# EAGLE design Detectors (EAGLE 5.04)
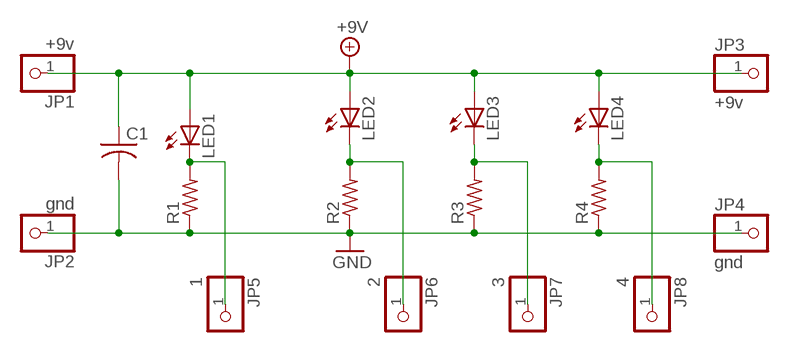
[diagram p0: schematic, sheet 1]

## Parts
C1  C-US050-035X075  [C050-035X075]
JP1  +9v  PINHD-1X1  [1X01]
JP2  gnd  PINHD-1X1  [1X01]
JP3  +9v  PINHD-1X1  [1X01]
JP4  gnd  PINHD-1X1  [1X01]
JP5  1  PINHD-1X1  [1X01]
JP6  2  PINHD-1X1  [1X01]
JP7  3  PINHD-1X1  [1X01]
JP8  4  PINHD-1X1  [1X01]
LED1  LED5MM  [LED5MM]
LED2  LED5MM  [LED5MM]
LED3  LED5MM  [LED5MM]
LED4  LED5MM  [LED5MM]
R1  R-US_0204/7  [0204/7]
R2  R-US_0204/7  [0204/7]
R3  R-US_0204/7  [0204/7]
R4  R-US_0204/7  [0204/7]

## Nets
+9V: C1.1 JP1.1 JP3.1 LED1.A LED2.A LED3.A LED4.A
GND: C1.2 JP2.1 JP4.1 R1.1 R2.1 R3.1 R4.1
N$3: JP5.1 LED1.K(C) R1.2
N$4: JP6.1 LED2.K(C) R2.2
N$5: JP7.1 LED3.K(C) R3.2
N$6: JP8.1 LED4.K(C) R4.2

## Library data of the parts
C1 = adafruit:C-US: CAPACITOR, American symbol
JP1-JP8 = adafruit:PINHD-1X1: Pin header 1x1 for 0.1" spacing With round pins
LED1-LED4 = adafruit:LED: LED OSRAM: - CHIPLED LG R971, LG N971, LY N971, LG Q971, LY Q971, LO R971, LY R971 LH N974, LH R974 LS Q976, LO Q976, LY Q976 LO Q996 - Hyper CHIPLED LW Q18S LB Q993, LB Q99A, LB R99A - SideLED LS A670, LO A670, LY A670, LG A670, LP A670 LB A673, LV A673, LT A673, LW A673 LH A674 LY A675 LS A676, LA A676, LO A676, LY A676, LW A676 LS A679, LY A679, LG A679 - Hyper Micro SIDELED® LS Y876, LA Y876, LO Y876, LY Y876 LT Y87S - SmartLED LW L88C, LW L88S LB L89C, LB L89S, LG L890 LS L89K, LO L89K, LY L89K LS L896, LA L896, LO L896, LY L896 - TOPLED LS T670, LO T670, LY T670, LG T670, LP T670 LSG T670, LSP T670, LSY T670, LOP T670, LYG T670 LG T671, LOG T671, LSG T671 LB T673, LV T673, LT T673, LW T673 LH T674 LS T676, LA T676, LO T676, LY T676, LB T676, LH T676, LSB T676, LW T676 LB T67C, LV T67C, LT T67C, LS T67K, LO T67K, LY T67K, LW E67C LS E67B, LA E67B, LO E67B, LY E67B, LB E67C, LV E67C, LT E67C LW T67C LS T679, LY T679, LG T679 LS T770, LO T770, LY T770, LG T770, LP T770 LB T773, LV T773, LT T773, LW T773 LH T774 LS E675, LA E675, LY E675, LS T675 LS T776, LA T776, LO T776, LY T776, LB T776 LHGB T686 LT T68C, LB T68C - Hyper Mini TOPLED® LB M676 - Mini TOPLED Santana® LG M470 LS M47K, LO M47K, LY M47K Source: http://www.osram.convergy.de/
R1-R4 = adafruit:R-US_: RESISTOR, American symbol

## Board
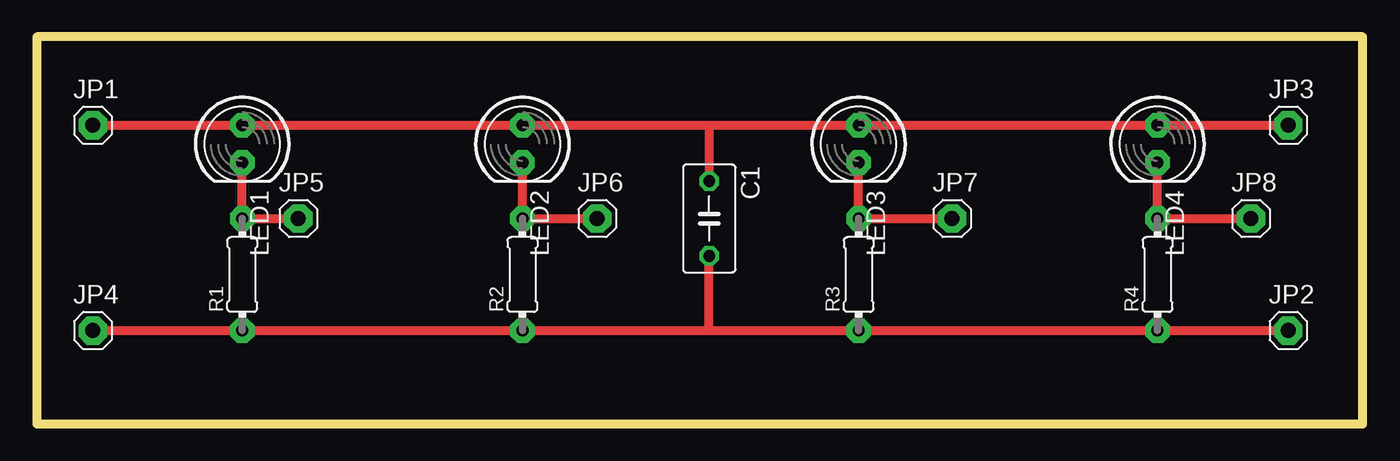
[diagram p1: board, top side]

Size 90.15 x 26.34 mm. Coordinates in mm from the lower left corner, seen from the top.
Outline: 0,0 90.15,0 90.15,26.34 0,26.34 0,0
Copper layers (1*16): Top 0.035mm / dielectric 1.5mm / Bottom 0.035mm
Design rules "default": minimum track width 10mil, minimum drill 24mil, track to track 8mil, track to pad 8mil, pad to pad 8mil, via to via 8mil, smd to smd 8mil, copper to edge 40mil, drill to drill 8mil, minimum pad ring 10mil, minimum via ring 8mil, stop-mask expansion 4mil, vias tented up to drill 0mil, thermal gap 10mil

### Footprints (pad centres in the part's own frame; a part is rotated, then mirrored left to right if it is on the bottom)
C050-035X075 = drill 0.813 octagon: 1 -2.54,0; 2 2.54,0
1X01 = drill 1.016 pad 1.93 octagon: 1 0,0
LED5MM = drill 0.813 pad 1.676 octagon: A -1.27,0; K 1.27,0
0204/7 = drill 0.813 pad 1.676 octagon: 1 -3.81,0; 2 3.81,0

### Placement (x,y rotation side)
C1  45.72,13.97 270 top
JP1  3.81,20.32 0 top
JP2  85.09,6.35 0 top
JP3  85.09,20.32 0 top
JP4  3.81,6.35 0 top
JP5  17.78,13.97 0 top
JP6  38.1,13.97 0 top
JP7  62.23,13.97 0 top
JP8  82.55,13.97 0 top
LED1  13.97,19.05 270 top
LED2  33.02,19.05 270 top
LED3  55.88,19.05 270 top
LED4  76.2,19.05 270 top
R1  13.97,10.16 90 top
R2  33.02,10.16 90 top
R3  55.88,10.16 90 top
R4  76.2,10.16 90 top

### Tracks (layer width: path | path; a pad name or v marks a point on that pad's centre or on a via)
+9V
  Top 0.61: JP1.1 LED1.A LED2.A 45.72,20.32 | 45.72,20.32 C1.1 | JP3.1 LED4.A LED3.A 45.72,20.32
GND
  Top 0.61: JP4.1 R1.1 R2.1 45.72,6.35 | 45.72,6.35 C1.2 | JP2.1 R4.1 R3.1 45.72,6.35
N$3
  Top 0.61: LED1.K R1.2 JP5.1
N$4
  Top 0.61: LED2.K R2.2 JP6.1
N$5
  Top 0.61: LED3.K R3.2 JP7.1
N$6
  Top 0.61: LED4.K R4.2 JP8.1